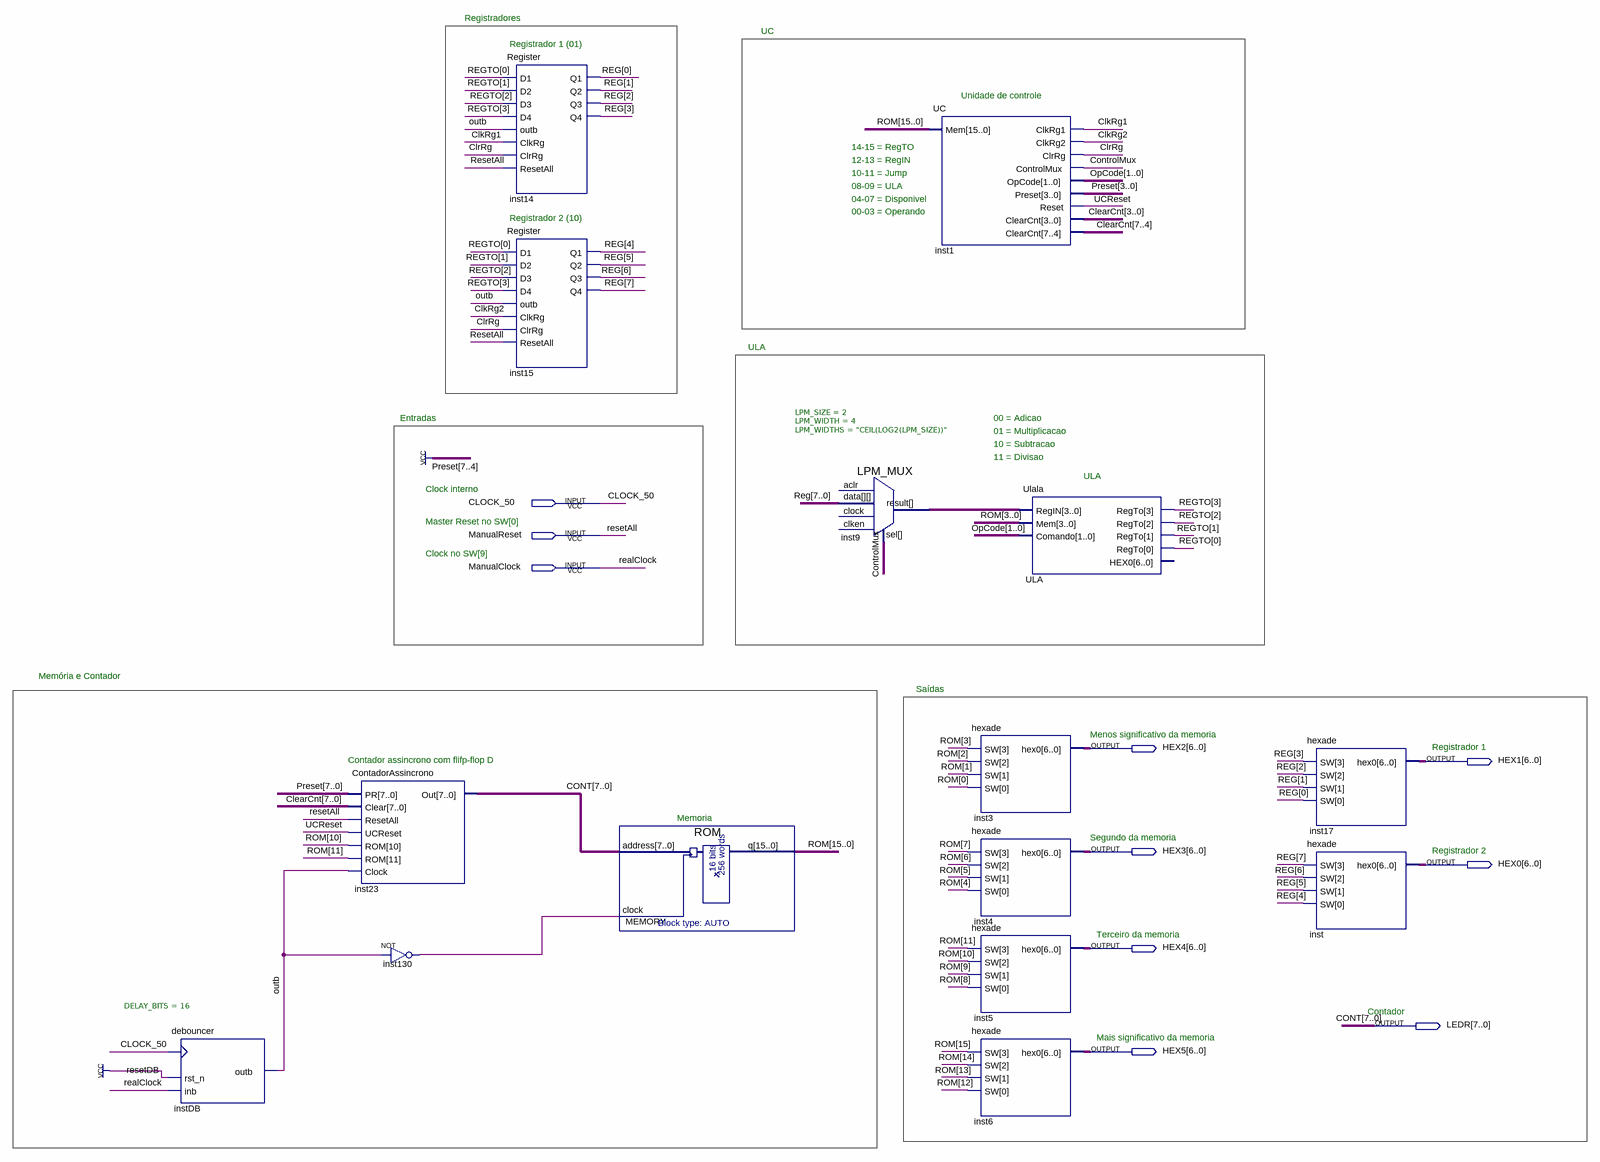
[diagram p0: schematic sheet]
// Quartus schematic CPU.bdf as structural Verilog: 15 symbols, 10 pins
module CPU (
  input  CLOCK_50,
  input  ManualReset,
  input  ManualClock,
  output [6:0] HEX2,
  output [6:0] HEX1,
  output [6:0] HEX3,
  output [6:0] HEX0,
  output [6:0] HEX4,
  output [7:0] LEDR,
  output [6:0] HEX5
);

  wire ClkRg1, ClkRg2, ClrRg, ControlMux, inst130_out, outb, UCReset;
  wire [1:0] OpCode;
  wire [3:0] inst9_result, Preset, REGTO;
  wire [7:0] ClearCnt, Reg;
  wire [15:0] ROM;

  debouncer #(.DELAY_BITS(16)) instDB (.rst_n(1'b1), .inb(ManualClock), .clk(CLOCK_50), .outb(outb));
  ContadorAssincrono inst23 (
    .PR({4'b1111, Preset}), .Clear(ClearCnt), .ResetAll(ManualReset), .UCReset(UCReset), .ROM(ROM[11:10]),
    .Clock(outb), .Out(LEDR));
  not inst130 (inst130_out, outb);
  Register inst14 (
    .D1(REGTO[0]), .D2(REGTO[1]), .D3(REGTO[2]), .D4(REGTO[3]), .outb(outb), .ClkRg(ClkRg1), .ClrRg(ClrRg),
    .ResetAll(ManualReset), .Q1(Reg[0]), .Q2(Reg[1]), .Q3(Reg[2]), .Q4(Reg[3]));
  Register inst15 (
    .D1(REGTO[0]), .D2(REGTO[1]), .D3(REGTO[2]), .D4(REGTO[3]), .outb(outb), .ClkRg(ClkRg2), .ClrRg(ClrRg),
    .ResetAll(ManualReset), .Q1(Reg[4]), .Q2(Reg[5]), .Q3(Reg[6]), .Q4(Reg[7]));
  ROM MEMORY (.address(LEDR), .clock(inst130_out), .q(ROM));
  LPM_MUX #(.LPM_SIZE(2), .LPM_WIDTH(4), .LPM_WIDTHS("CEIL(LOG2(LPM_SIZE))")) inst9 (
    .data(Reg), .sel(ControlMux), .result(inst9_result));  // open: clock, aclr, clken
  UC inst1 (
    .Mem(ROM), .ClkRg1(ClkRg1), .ClkRg2(ClkRg2), .ClrRg(ClrRg), .ControlMux(ControlMux), .OpCode(OpCode),
    .Preset(Preset), .Reset(UCReset), .ClearCnt(ClearCnt));
  hexade inst3 (.SW(ROM[3:0]), .hex0(HEX2));
  hexade inst4 (.SW(ROM[7:4]), .hex0(HEX3));
  hexade inst5 (.SW(ROM[11:8]), .hex0(HEX4));
  hexade inst6 (.SW(ROM[15:12]), .hex0(HEX5));
  Ulala ULA (.RegIN(inst9_result), .Mem(ROM[3:0]), .Comando(OpCode), .RegTo(REGTO));  // open: HEX0
  hexade inst17 (.SW(Reg[3:0]), .hex0(HEX1));
  hexade inst (.SW(Reg[7:4]), .hex0(HEX0));

  // Other names for the same wires on the sheet: CONT[7:0] = LEDR; realClock = ManualClock; resetAll = ManualReset

  // Notes on the sheet:
  //   Registradores
  //   UC
  //   Registrador 1 (01)
  //   Unidade de controle
  //   14-15 = RegTO
  //   12-13 = RegIN
  //   10-11 = Jump
  //   08-09 = ULA
  //   04-07 = Disponivel
  //   00-03 = Operando
  //   Registrador 2 (10)
  //   ULA
  //   Entradas
  //   00 = Adicao
  //   01 = Multiplicacao
  //   10 = Subtracao
  //   11 = Divisao
  //   ULA
  //   Clock interno
  //   Master Reset no SW[0]
  //   Clock no SW[9]
  //   Memória e Contador
  //   Saídas
  //   Menos significativo da memoria
  //   Registrador 1
  //   Contador assincrono com flifp-flop D
  //   Memoria
  //   Segundo da memoria
  //   Registrador 2
  //   Terceiro da memoria
  //   Contador
  //   Mais significativo da memoria
endmodule
